# Altium schematic sheet HW_Mechanical_Parts.SchDoc: HW Mechanical parts
size A4; Date: 19/04/2016; Author: N.P; CompanyName: STMicroelectronics; Organization: MCD/APPLIS/LMS; DocumentNumber: 13; SheetNumber: 13; SheetTotal: 13; Project: STM32F723e-DISCO
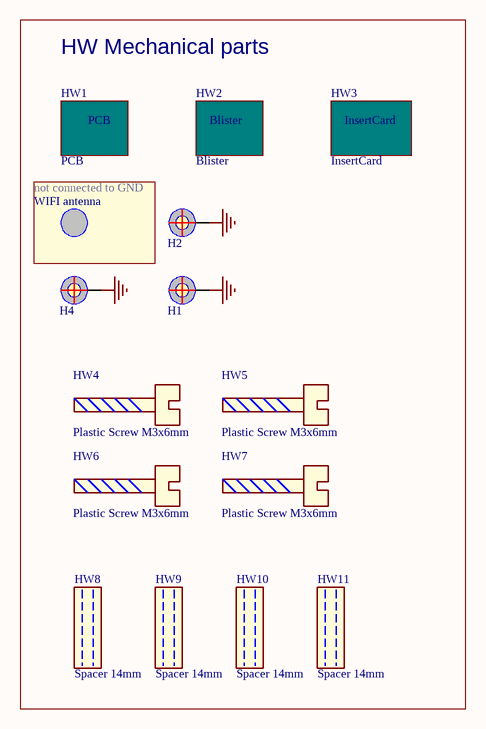
[diagram p0: HW_Mechanical_Parts.SchDoc]

## Parts
H1  POSITION HOLE C6D3R5  [HOLE_C6D3R5]  (value not drawn)  (no BOM)
H2  POSITION HOLE C6D3R5  [HOLE_C6D3R5]  (value not drawn)  (no BOM)
H4  POSITION HOLE C6D3R5  [HOLE_C6D3R5]  (value not drawn)  (no BOM)
HW1  PCB
HW2  Blister
HW3  InsertCard
HW4  Plastic Screw M3x6mm  (mechanical)
HW5  Plastic Screw M3x6mm  (mechanical)
HW6  Plastic Screw M3x6mm  (mechanical)
HW7  Plastic Screw M3x6mm  (mechanical)
HW8  Spacer 14mm  (mechanical)
HW9  Spacer 14mm  (mechanical)
HW10  Spacer 14mm  (mechanical)
HW11  Spacer 14mm  (mechanical)

## Nets
GND: H1.1 H2.1 H4.1

## Notes on the sheet
- HW Mechanical parts
- (near H2) not connected to GND
- WIFI antenna
- Title:
- Project:
- Size:
- Revision:
- Variant:
- A4
- -
- Date:
- Reference:
- Sheet:
- of

## Library data of the parts
H1 H2 H4 = POSITION HOLE C6D3R5: Fitted: NO; Ordered by: Subcon; ECCN_US/EU: n/a
HW1 = PCB: Manuf_Part_1: MB1260 PCB; Manuf_1: Jiubaba; Ordered by: Subcon; Fitted: YES; Revision: 17-Jul-2002: Re-released for DXP Platform.; ECCN_US/EU: n/a
HW2 = Blister: Manuf_Part_1: MB1260 Blister; Manuf_1: Jiubaba; Ordered by: Subcon; Fitted: YES; Revision: 17-Jul-2002: Re-released for DXP Platform.; ECCN_US/EU: n/a
HW3 = InsertCard: Manuf_Part_1: MB1260 InsertCard; Manuf_1: Jiubaba; Ordered by: Subcon; Fitted: YES; Revision: 17-Jul-2002: Re-released for DXP Platform.; ECCN_US/EU: n/a
HW4-HW7 = Plastic Screw M3x6mm: Plastic screw; Ordered_By: Subcon; Fitted: YES; Manuf_1: *; Manuf_Part_1: *; Order_Code: *; Distrib: *; ECCN_US/EU: n/a; Value: Screw M3x6mm; Ordered by: Subcon
HW8-HW11 = Plastic Spacer D4.5x14, M3x0.5: Plastic spacer; Manuf_1: RAF; Manuf_Part_1: M1261-3005-N; Ordered_By: Subcon; Fitted: YES; Order code RS: *; Distrib: *; ECCN_US/EU: n/a; Value: Spacer 14mm; Ordered by: Subcon